# Altium schematic sheet top_level.SchDoc
size A4
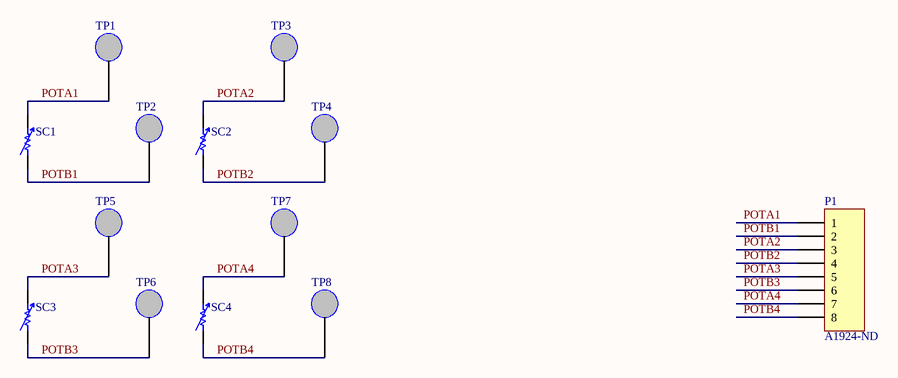
[diagram p0: top_level.SchDoc]

## Parts
P1  Supplier Part Number 1: A1924-ND  [CON-HEADER-1X8]  (hidden comment: CON - HEADER 1X8)
SC1  RS - RESISTOR VARIABLE  [SC - KXOB22-04X3L]  (value not drawn)
SC2  RS - RESISTOR VARIABLE  [SC - KXOB22-04X3L]  (value not drawn)
SC3  RS - RESISTOR VARIABLE  [SC - KXOB22-04X3L]  (value not drawn)
SC4  RS - RESISTOR VARIABLE  [SC - KXOB22-04X3L]  (value not drawn)
TP1  5003K  [TP - VERTICAL]  (value not drawn)
TP2  5003K  [TP - VERTICAL]  (value not drawn)
TP3  5003K  [TP - VERTICAL]  (value not drawn)
TP4  5003K  [TP - VERTICAL]  (value not drawn)
TP5  5003K  [TP - VERTICAL]  (value not drawn)
TP6  5003K  [TP - VERTICAL]  (value not drawn)
TP7  5003K  [TP - VERTICAL]  (value not drawn)
TP8  5003K  [TP - VERTICAL]  (value not drawn)

## Nets
POTA1: P1.1 SC1.2 TP1.1
POTA2: P1.3 SC2.2 TP3.1
POTA3: P1.5 SC3.2 TP5.1
POTA4: P1.7 SC4.2 TP7.1
POTB1: P1.2 SC1.1 TP2.1
POTB2: P1.4 SC2.1 TP4.1
POTB3: P1.6 SC3.1 TP6.1
POTB4: P1.8 SC4.1 TP8.1

## Library data of the parts
P1 = CON - HEADER 1X8: 100mil header 1 row 6 pins; Manufacturer: *; (FIELD A): *; (FIELD B): *; (FIELD C): *; Supplier 1: Digi-Key
SC1-SC4 = RS - RESISTOR VARIABLE: TOLERANCE: RES TOL; POWER: RES POWER; Supplier Part Number 1: KXOB22-04X3L-ND; Supplier 1: Digikey; (FIELD A): *; (FLIED C): *; (FIELD B): *; Manufacturer: *
TP1-TP8 = TP - Test point vertical: (FIELD A): *; (FIELD B): *; (FIELD C): *; Manufacturer: *; Supplier 1: Newark; Supplier Part Number 1: 62W5140